# EasyEDA schematic Schematic_16bitCalculator.json
TITLE: Simple 16bit Calculator; REV: 1.0; Date: 2023-09-03; Sheet: 1/1; Drawn By: NguyenPhamTienDung; Company: Group02
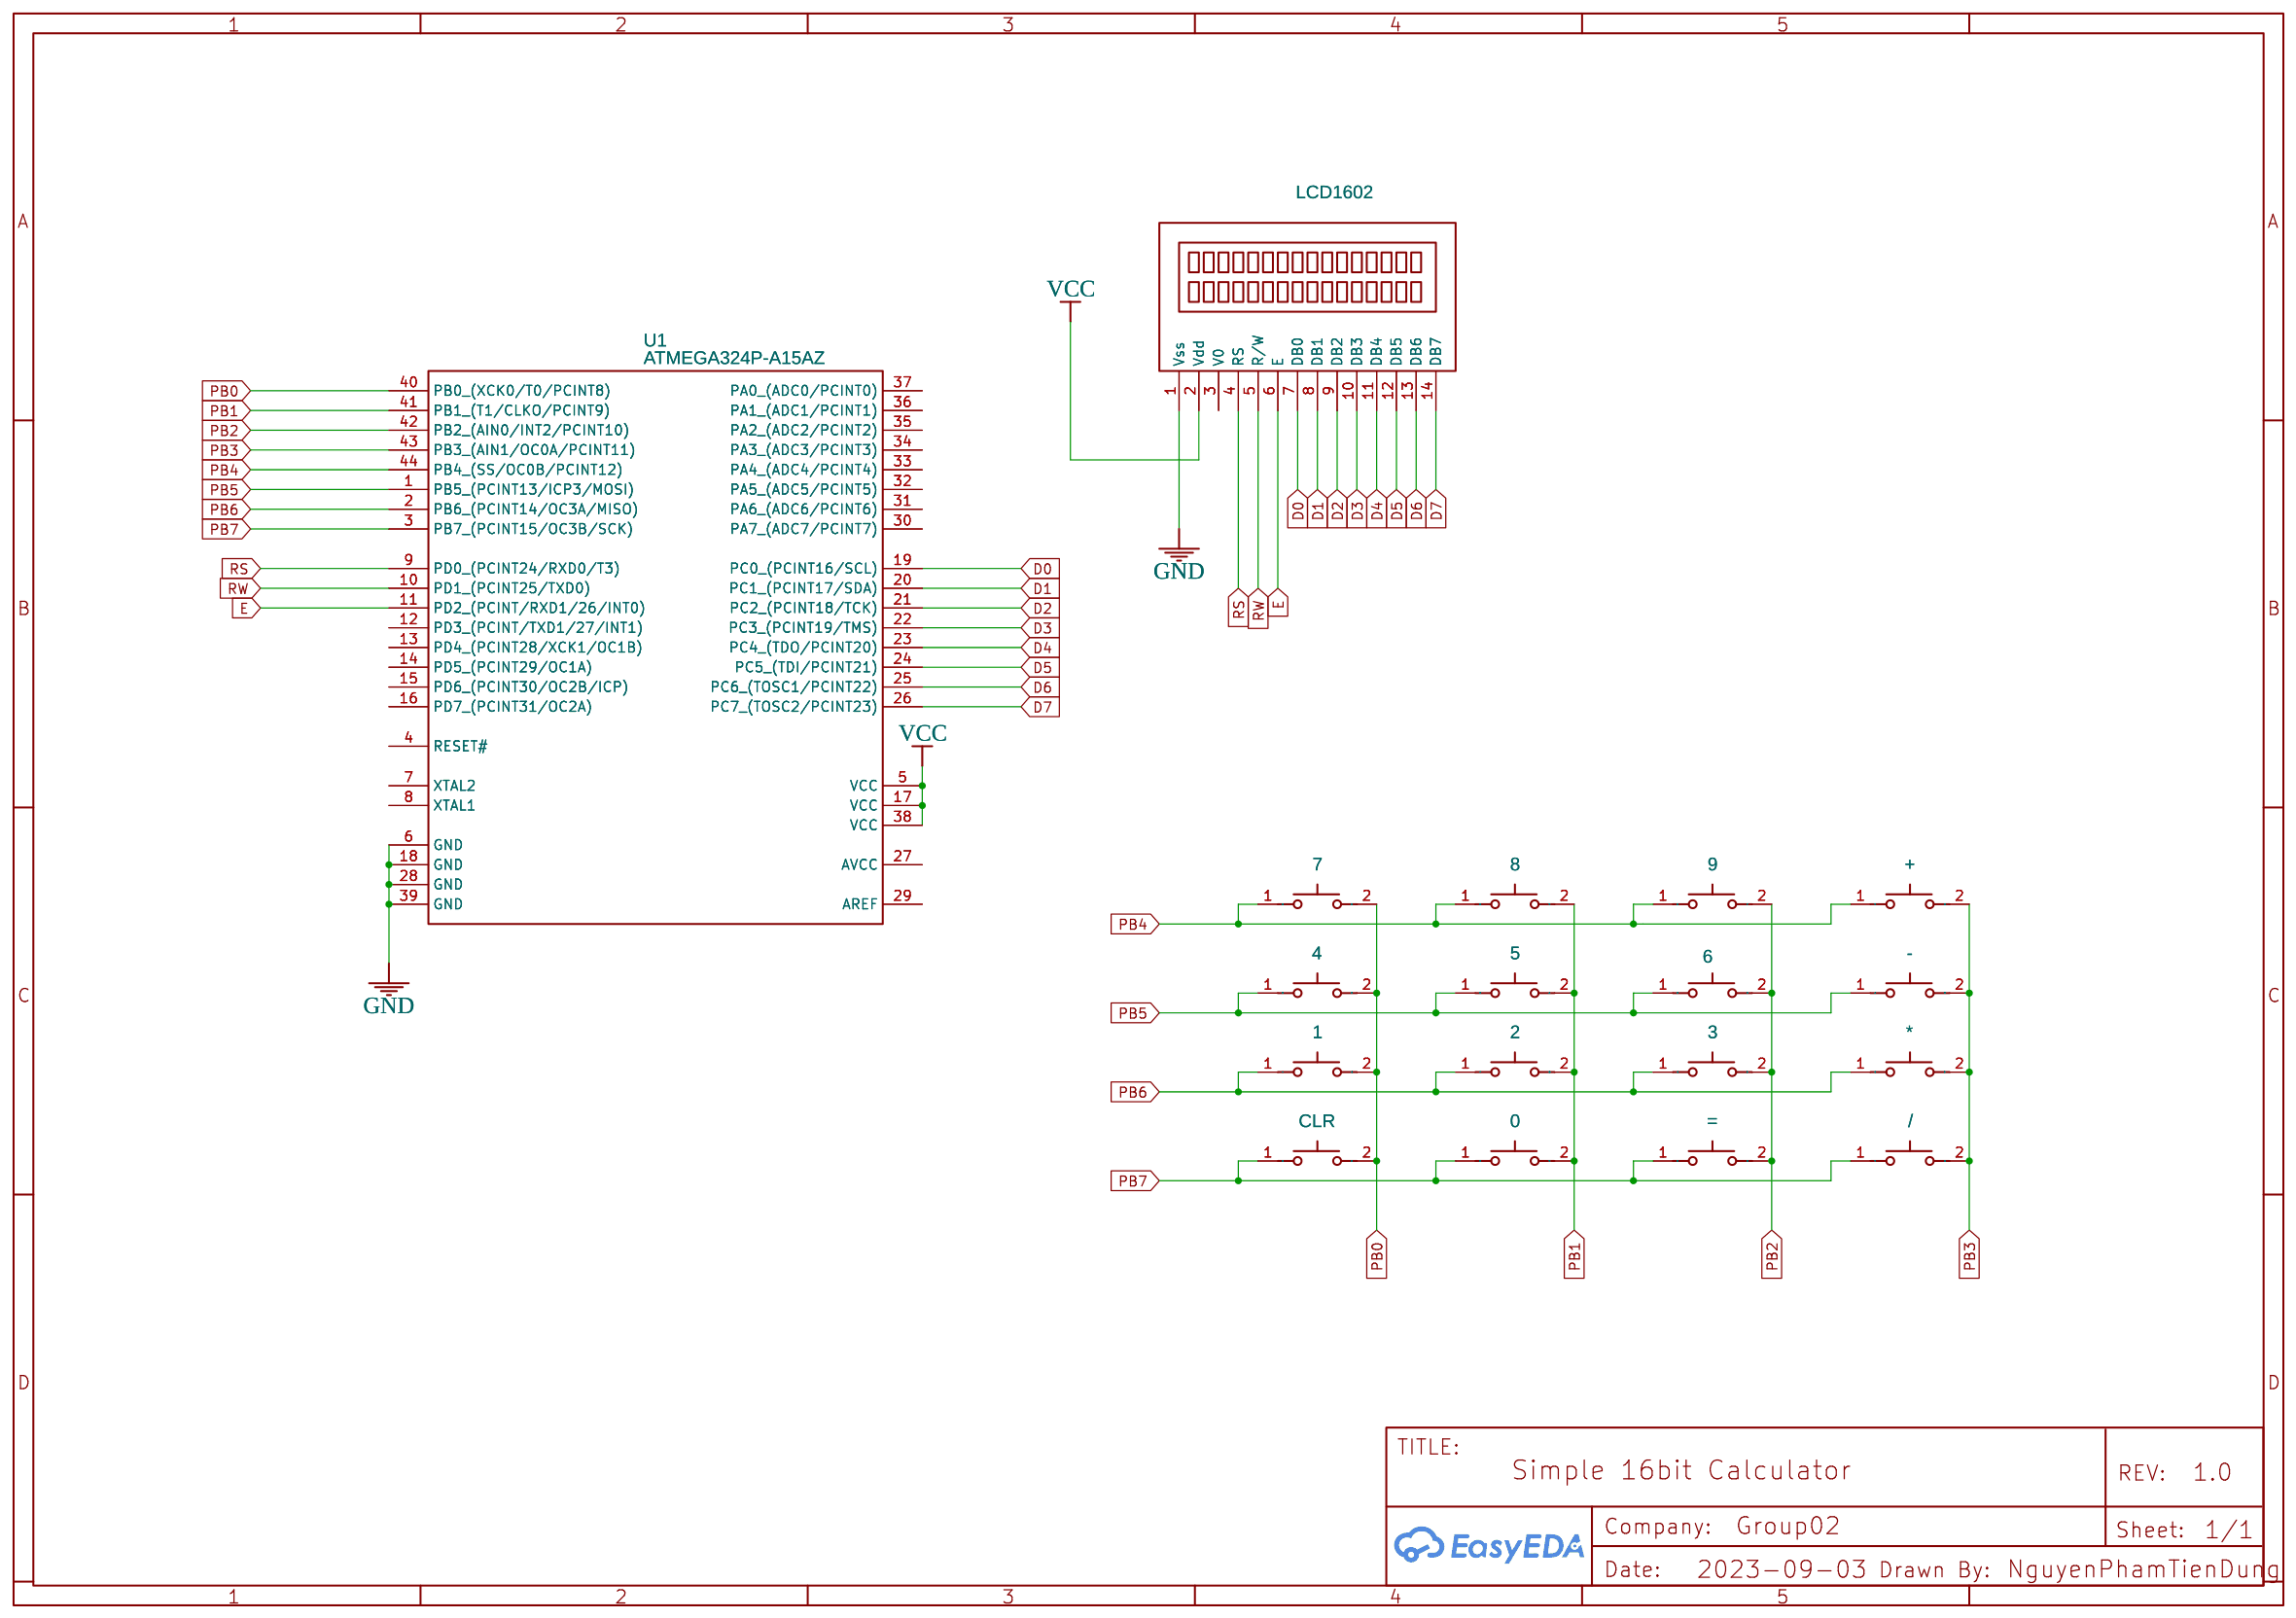
[diagram p0: schematic sheet]

## Parts
0  BUTTON2  [SW-SMD_L6.0-W3.5-LS8.0-1]
1  BUTTON2  [SW-SMD_L6.0-W3.5-LS8.0-1]
2  BUTTON2  [SW-SMD_L6.0-W3.5-LS8.0-1]
3  BUTTON2  [SW-SMD_L6.0-W3.5-LS8.0-1]
4  BUTTON2  [SW-SMD_L6.0-W3.5-LS8.0-1]
5  BUTTON2  [SW-SMD_L6.0-W3.5-LS8.0-1]
6  BUTTON2  [SW-SMD_L6.0-W3.5-LS8.0-1]
7  BUTTON2  [SW-SMD_L6.0-W3.5-LS8.0-1]
8  BUTTON2  [SW-SMD_L6.0-W3.5-LS8.0-1]
9  BUTTON2  [SW-SMD_L6.0-W3.5-LS8.0-1]
*  BUTTON2  [SW-SMD_L6.0-W3.5-LS8.0-1]
+  BUTTON2  [SW-SMD_L6.0-W3.5-LS8.0-1]
-  BUTTON2  [SW-SMD_L6.0-W3.5-LS8.0-1]
/  BUTTON2  [SW-SMD_L6.0-W3.5-LS8.0-1]
=  BUTTON2  [SW-SMD_L6.0-W3.5-LS8.0-1]
CLR  BUTTON2  [SW-SMD_L6.0-W3.5-LS8.0-1]
LCD1602  NO  [LM016L]
U1  ATMEGA324P-A15AZ  [TQFP-44_L10.0-W10.0-P0.80-LS12.0-BL]

## Library data of the parts
0-9 * + - / = CLR = BUTTON2: Contributor: LCSC; Supplier: LCSC; Supplier Part: C9900005988; Manufacturer: null; JLCPCB Part Class: Extended Part; link: https://lcsc.com/eda_search?q=C9900005988&%26type=1&ref=editor
LCD1602 = LM016L: Manufacturer Part: LCD LM016L 16x2; Contributor: macdinhduc123456789
U1 = ATMEGA324P-A15AZ: Contributor: lcsc; Supplier: LCSC; Supplier Part: C3226472; Manufacturer: Atmel; link: https://lcsc.com/eda_search?q=C3226472&%26type=1&ref=editor

## Nets
GND: LCD1602.1(Vss) U1.6(GND) U1.18(GND) U1.28(GND) U1.39(GND)
VCC: LCD1602.2(Vdd) U1.5(VCC) U1.17(VCC) U1.38(VCC)
D0: LCD1602.7(DB0) U1.19(PC0 (PCINT16/SCL))
D1: LCD1602.8(DB1) U1.20(PC1 (PCINT17/SDA))
D2: LCD1602.9(DB2) U1.21(PC2 (PCINT18/TCK))
D3: LCD1602.10(DB3) U1.22(PC3 (PCINT19/TMS))
D4: LCD1602.11(DB4) U1.23(PC4 (TDO/PCINT20))
D5: LCD1602.12(DB5) U1.24(PC5 (TDI/PCINT21))
D6: LCD1602.13(DB6) U1.25(PC6 (TOSC1/PCINT22))
D7: LCD1602.14(DB7) U1.26(PC7 (TOSC2/PCINT23))
E: LCD1602.6(E) U1.11(PD2 (PCINT/RXD1/26/INT0))
PB0: 1.2 4.2 7.2 CLR.2 U1.40(PB0 (XCK0/T0/PCINT8))
PB1: 0.2 2.2 5.2 8.2 U1.41(PB1 (T1/CLKO/PCINT9))
PB2: 3.2 6.2 9.2 =.2 U1.42(PB2 (AIN0/INT2/PCINT10))
PB3: *.2 +.2 -.2 /.2 U1.43(PB3 (AIN1/OC0A/PCINT11))
PB4: 7.1 8.1 9.1 +.1 U1.44(PB4 (SS/OC0B/PCINT12))
PB5: 4.1 5.1 6.1 -.1 U1.1(PB5 (PCINT13/ICP3/MOSI))
PB6: 1.1 2.1 3.1 *.1 U1.2(PB6 (PCINT14/OC3A/MISO))
PB7: 0.1 /.1 =.1 CLR.1 U1.3(PB7 (PCINT15/OC3B/SCK))
RS: LCD1602.4(RS) U1.9(PD0 (PCINT24/RXD0/T3))
RW: LCD1602.5(R/W) U1.10(PD1 (PCINT25/TXD0))

Not connected (* = marked no-connect by the designer): LCD1602 3(V0); U1 4(RESET#) 7(XTAL2) 8(XTAL1) 12(PD3 (PCINT/TXD1/27/INT1)) 13(PD4 (PCINT28/XCK1/OC1B)) 14(PD5 (PCINT29/OC1A)) 15(PD6 (PCINT30/OC2B/ICP)) 16(PD7 (PCINT31/OC2A)) 27(AVCC) 29(AREF) 30(PA7 (ADC7/PCINT7)) 31(PA6 (ADC6/PCINT6)) 32(PA5 (ADC5/PCINT5)) 33(PA4 (ADC4/PCINT4)) 34(PA3 (ADC3/PCINT3)) 35(PA2 (ADC2/PCINT2)) 36(PA1 (ADC1/PCINT1)) 37(PA0 (ADC0/PCINT0))
